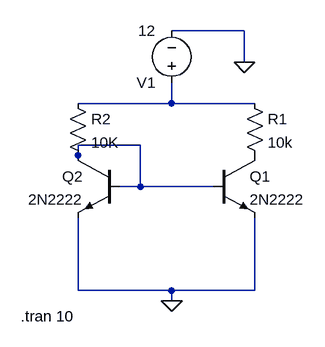
[diagram p0: schematic Current_Mirror.asc]
Current_Mirror.asc, the LTspice schematic file:
Version 4
SHEET 1 880 680
WIRE 320 -16 208 -16
WIRE 320 32 320 -16
WIRE 208 96 208 64
WIRE 208 96 64 96
WIRE 336 96 208 96
WIRE 160 160 64 160
WIRE 64 176 64 160
WIRE 160 224 160 160
WIRE 160 224 128 224
WIRE 272 224 160 224
WIRE 64 384 64 272
WIRE 208 384 64 384
WIRE 336 384 336 272
WIRE 336 384 208 384
WIRE 208 400 208 384
FLAG 208 400 0
FLAG 320 32 0
SYMBOL npn 272 176 R0
SYMATTR InstName Q1
SYMATTR Value 2N2222
SYMBOL npn 128 176 M0
SYMATTR InstName Q2
SYMATTR Value 2N2222
SYMBOL voltage 208 80 R180
WINDOW 123 0 0 Left 0
WINDOW 39 0 0 Left 0
SYMATTR InstName V1
SYMATTR Value 12
SYMBOL res 48 80 R0
SYMATTR InstName R2
SYMATTR Value 10K
SYMBOL res 320 80 R0
SYMATTR InstName R1
SYMATTR Value 10k
TEXT -24 424 Left 2 !.tran 10

The netlist it stands for:
* Current_Mirror.asc
Q1 P001 N002 0 0 2N2222
Q2 N002 N002 0 0 2N2222
V1 N001 0 12
R2 N001 N002 10K
R1 N001 P001 10k
.model NPN NPN
.model PNP PNP
.lib standard.bjt
.tran 10
.backanno
.end